# Altium project Class_D_Amp.PrjPcb
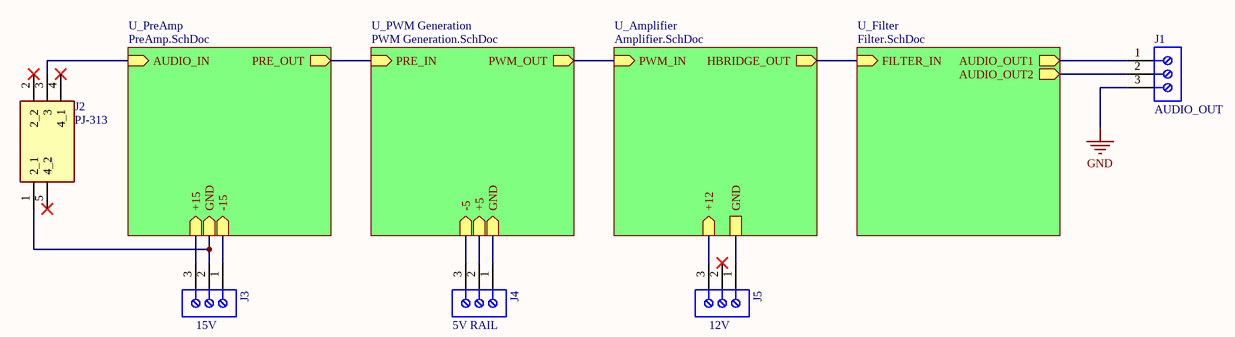
[diagram p0: Overview.SchDoc]
5 sheets, 63 parts. Net scope: hierarchical (ports join the sheet entries above them; power ports are global).
Board file: ClassD.PcbDoc
Sheets:
  Overview.SchDoc
    U_PreAmp = PreAmp.SchDoc
    U_Filter = Filter.SchDoc
    U_PWM Generation = PWM Generation.SchDoc
    U_Amplifier = Amplifier.SchDoc

## Sheet Overview.SchDoc
size A; SheetNumber: 1; SheetTotal: 5

### Parts
J1  AUDIO_OUT  [691137810003]
J2  PJ-313  [PJ313]
J3  15V  [691137810003]
J4  5V RAIL  [691137810003]
J5  12V  [691137810003]

### Sub-sheets
U_Amplifier = Amplifier.SchDoc: PWM_IN (in), HBRIDGE_OUT (out), +12 (in), GND
U_Filter = Filter.SchDoc: FILTER_IN (in), AUDIO_OUT1 (out), AUDIO_OUT2 (out)
U_PreAmp = PreAmp.SchDoc: AUDIO_IN (in), PRE_OUT (out), +15 (in), GND (in), -15 (in)
U_PWM Generation = PWM Generation.SchDoc: PRE_IN (in), PWM_OUT (out), -5 (in), +5 (in), GND (in)

### Nets
+5: J4.2 ; sheet U_PWM Generation/+5
+12: J5.3 ; sheet U_Amplifier/+12
+15: J3.3 ; sheet U_PreAmp/+15
-5: J4.3 ; sheet U_PWM Generation/-5
-15: J3.1 ; sheet U_PreAmp/-15
GND: J1.3 J2.1(2_1) J3.2 J4.1 J5.1 ; sheet U_PreAmp/GND, sheet U_PWM Generation/GND, sheet U_Amplifier/GND
AUDIO_IN: J2.3 ; sheet U_PreAmp/AUDIO_IN
AUDIO_OUT1: J1.1 ; sheet U_Filter/AUDIO_OUT1
AUDIO_OUT2: J1.2 ; sheet U_Filter/AUDIO_OUT2
PRE_OUT: sheet U_PreAmp/PRE_OUT, sheet U_PWM Generation/PRE_IN
PWM_IN: sheet U_PWM Generation/PWM_OUT, sheet U_Amplifier/PWM_IN
TS: sheet U_Filter/FILTER_IN, sheet U_Amplifier/HBRIDGE_OUT

Not connected (* = marked no-connect by the designer): J2 2(2_2)* 4(4_1)* 5(4_2)*; J5 2*

### Library data of the parts
J1 J3-J5 = CMP-1502-03382-3: 10.00 mm Terminal Block, Horizontal Entr / 691137810003
J2 = PJ-313: Connector; Manufacturer_Name: Haoyu; Datasheet Link: http://p.globalsources.com/IMAGES/PDT/SPEC/678/K1007224678.pdf; Height: 5mm; Manufacturer_Part_Number: PJ-313

## Sheet PreAmp.SchDoc
size A4; SheetNumber: 2; SheetTotal: 5
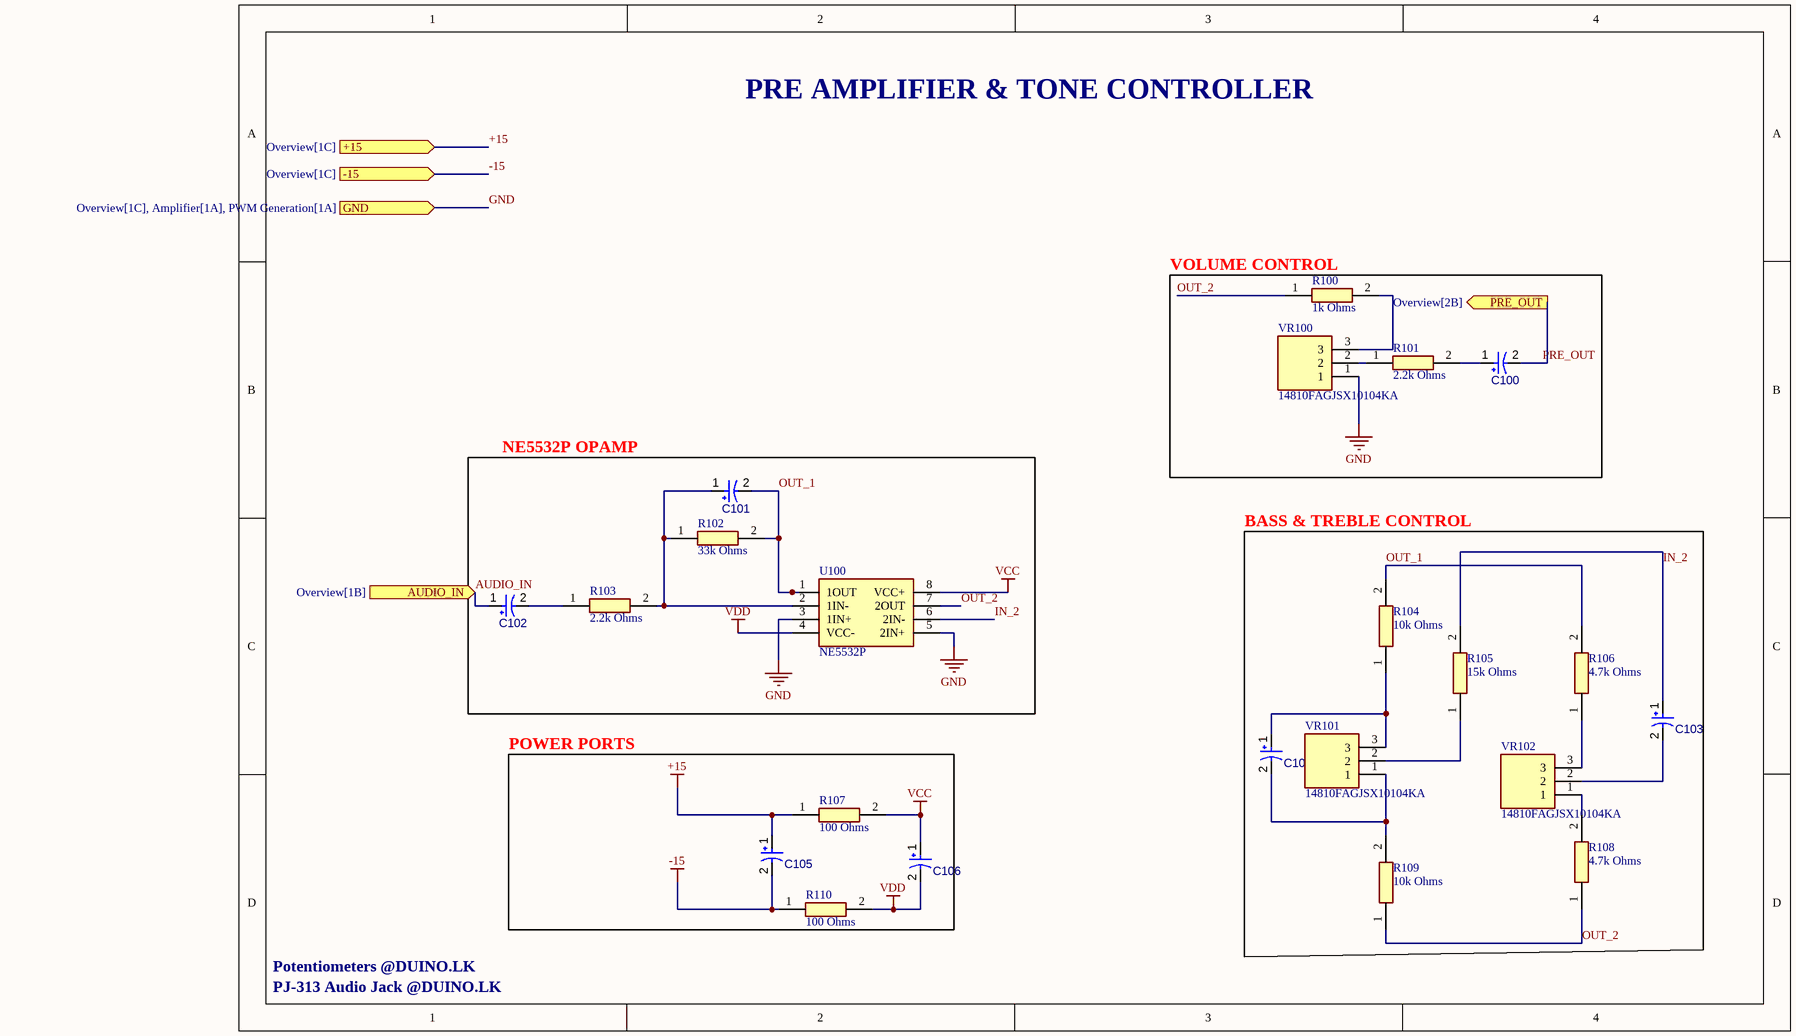
[diagram p1: PreAmp.SchDoc]

### Parts
C100  10uF  [CAPPR65-500-1600X1000X1700]  (value not drawn)
C101  47pF  [CAPPR65-500-1600X1000X1700]  (value not drawn)
C102  10uF  [CAPPR65-500-1600X1000X1700]  (value not drawn)
C103  2.2nF  [CAPPR65-500-1600X1000X1700]  (value not drawn)
C104  47nF  [CAPPR65-500-1600X1000X1700]  (value not drawn)
C105  1000uF  [CAPPR65-500-1600X1000X1700]  (value not drawn)
C106  100nF  [CAPPR65-500-1600X1000X1700]  (value not drawn)
R100  1k Ohms  [RESAD1650W60L650D250]
R101  2.2k Ohms  [RESAD1650W60L650D250]
R102  33k Ohms  [RESAD1650W60L650D250]
R103  2.2k Ohms  [RESAD1650W60L650D250]
R104  10k Ohms  [RESAD1650W60L650D250]
R105  15k Ohms  [RESAD1650W60L650D250]
R106  4.7k Ohms  [RESAD1650W60L650D250]
R107  100 Ohms  [RESAD1650W60L650D250]
R108  4.7k Ohms  [RESAD1650W60L650D250]
R109  10k Ohms  [RESAD1650W60L650D250]
R110  100 Ohms  [RESAD1650W60L650D250]
U100  NE5532P  [DIP794W53P254L959H508Q8N]
VR100  14810FAGJSX10104KA  [14810FAGJSX10104KA]
VR101  14810FAGJSX10104KA  [14810FAGJSX10104KA]
VR102  14810FAGJSX10104KA  [14810FAGJSX10104KA]

### Blocks framed on the sheet
VOLUME CONTROL: C100 R100 R101 VR100
NE5532P OPAMP: C101 C102 R102 R103 U100
BASS & TREBLE CONTROL: C103 C104 R104-R106 R108 R109 VR101 VR102
POWER PORTS: C105 C106 R107 R110

### Ports
+15 (in, see Overview[1C]), -15 (in, see Overview[1C]), AUDIO_IN (in, see Overview[1B]), GND (in, see Overview[1C], Amplifier[1A], PWM Generation[1A]), PRE_OUT (out, see Overview[2B])

### Nets
+15: C105.1 R107.1 ; port +15
-15: C105.2 R110.1 ; port -15
GND: U100.3(1IN+) U100.5(2IN+) VR100.1 ; port GND
VCC: C106.1 R107.2 U100.8(VCC+)
VDD: C106.2 R110.2 U100.4(VCC-)
AUDIO_IN: C102.1 ; port AUDIO_IN
IN_2: C103.1 R105.2 U100.6(2IN-)
OUT_1: C101.2 R102.2 R104.2 R106.2 U100.1(1OUT)
OUT_2: R100.1 R108.1 R109.1 U100.7(2OUT)
PRE_OUT: C100.2 ; port PRE_OUT
NetC100_1: C100.1 R101.2
NetC101_1: C101.1 R102.1 R103.2 U100.2(1IN-)
NetC102_2: C102.2 R103.1
NetC103_2: C103.2 VR102.2
NetC104_1: C104.1 R104.1 VR101.3
NetC104_2: C104.2 R109.2 VR101.1
NetR100_2: R100.2 VR100.3
NetR101_1: R101.1 VR100.2
NetR105_1: R105.1 VR101.2
NetR106_1: R106.1 VR102.3
NetR108_2: R108.2 VR102.1

### Notes on the sheet
- PRE AMPLIFIER & TONE CONTROLLER
- Potentiometers @DUINO.LK
- PJ-313 Audio Jack @DUINO.LK

### Library data of the parts
C100-C106 = CMP-001-00034-7: Manufacturer: Panasonic; Capacitor Type: Electrolytic; Voltage Rating: 100V; Tolerance: 20%; Value: 100µF; Ripple Current: 350mA; Mounting Technology: TH; Case/Package: Radial; Pins: 2; RoHS Compliant: True; Min Operating Temperature: -40°C; Max Operating Temperature: 85°C; Ripple Current (AC): 350mA; Package Quantity: 200; Package Description: 2-Pin Through Hole Device, Dia 10 mm, Body Length 16 mm; Package Reference: CAPPR65-500-1600X1000X1700; Datasheet URL: https://industrial.panasonic.com/cdbs/www-data/pdf/RDF0000/ABA0000C1047.pdf; Manufacturer URL: http://www.panasonic.com/; Packaging: Bulk; Datasheet Version: Mar-16; Diameter: 10mm; Lead Pitch: 5mm
R100-R110 = MRS25000C1052FCT00: Resistor; Manufacturer_Name: Vishay; Datasheet Link: http://www.vishay.com/docs/28724/mrs16m25.pdf; Manufacturer_Part_Number: MRS25000C1052FCT00; Mouser Part Number: 594-MRS25000C1052FCT; Mouser Price/Stock: https://www.mouser.co.uk/ProductDetail/Vishay-BC-Components/MRS25000C1052FCT00?qs=17u8i%2FzlE88YYQWf3OHpPg%3D%3D
U100 = NE5532P: Integrated Circuit; Manufacturer_Name: Texas Instruments; Datasheet Link: http://www.ti.com/lit/ds/symlink/ne5532a.pdf; Height: 5.08mm; Manufacturer_Part_Number: NE5532P; Mouser Part Number: 595-NE5532P; Mouser Price/Stock: https://www.mouser.co.uk/ProductDetail/Texas-Instruments/NE5532P?qs=3pnr37ZAbK%252Bre0OAHDmGsw%3D%3D; Arrow Part Number: NE5532P; Arrow Price/Stock: https://www.arrow.com/en/products/ne5532p/texas-instruments?region=nac
VR100-VR102 = 14810FAGJSX10104KA: Variable Resistor; Manufacturer_Name: Vishay; Datasheet Link: https://www.mouser.co.uk/datasheet/2/427/148149-239924.pdf; Height: 13.1mm; Manufacturer_Part_Number: 14810FAGJSX10104KA; Mouser Part Number: 594-148-7104; Mouser Price/Stock: https://www.mouser.co.uk/ProductDetail/Vishay-Spectrol/14810FAGJSX10104KA?qs=jxJUw0%2FAXLKQRjwLM10Vhg%3D%3D

## Sheet Filter.SchDoc
size 114 x 127 mm; SheetNumber: 4; SheetTotal: 5
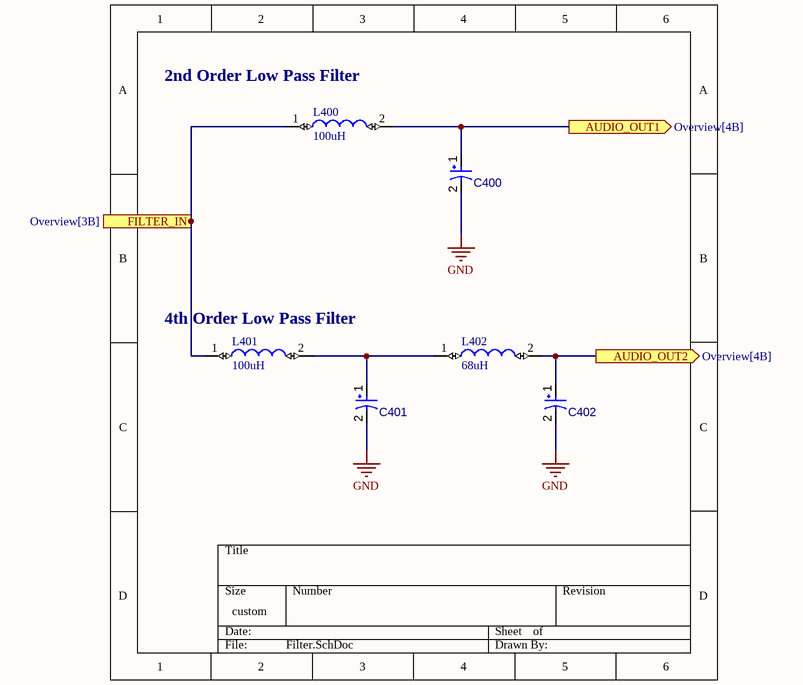
[diagram p2: Filter.SchDoc]

### Parts
C400  630nF  [CAPPR65-500-1600X1000X1700]  (value not drawn)
C401  1.5uF  [CAPPR65-500-1600X1000X1700]  (value not drawn)
C402  390nF  [CAPPR65-500-1600X1000X1700]  (value not drawn)
L400  100uH  [RLB0914]
L401  100uH  [RLB0914]
L402  68uH  [RLB0914]

### Ports
AUDIO_OUT1 (out, see Overview[4B]), AUDIO_OUT2 (out, see Overview[4B]), FILTER_IN (in, see Overview[3B])

### Nets
GND: C400.2 C401.2 C402.2
AUDIO_OUT1: C400.1 L400.2 ; port AUDIO_OUT1
AUDIO_OUT2: C402.1 L402.2 ; port AUDIO_OUT2
TS: L400.1 L401.1 ; port FILTER_IN
NetC401_1: C401.1 L401.2 L402.1

### Notes on the sheet
- (near L400) 2nd Order Low Pass Filter
- (near L401) 4th Order Low Pass Filter

### Library data of the parts
C400-C402 = CMP-001-00034-7: as C100 on sheet PreAmp; Mounting Technology: TH; Case/Package: Radial; Pins: 2; RoHS Compliant: True; Min Operating Temperature: -40°C; Max Operating Temperature: 85°C; Ripple Current (AC): 350mA; Package Quantity: 200; Package Description: 2-Pin Through Hole Device, Dia 10 mm, Body Length 16 mm; Package Reference: CAPPR65-500-1600X1000X1700; Datasheet URL: https://industrial.panasonic.com/cdbs/www-data/pdf/RDF0000/ABA0000C1047.pdf; Manufacturer URL: http://www.panasonic.com/; Packaging: Bulk; Datasheet Version: Mar-16; Diameter: 10mm; Lead Pitch: 5mm
L400-L402 = RLB0914-101KL: 100uH Through Hole Inductor; Manufacturer_Name: Bourns; Datasheet Link: https://componentsearchengine.com/Datasheets/2/RLB0914-101KL.pdf; Manufacturer_Part_Number: RLB0914-101KL; Mouser Part Number: 652-RLB0914-101KL; Mouser Price/Stock: https://www.mouser.co.uk/ProductDetail/Bourns/RLB0914-101KL?qs=AC4ivEYFOTDvh%252BZyhliaeA%3D%3D; Arrow Part Number: RLB0914-101KL; Arrow Price/Stock: https://www.arrow.com/en/products/rlb0914-101kl/bourns?region=europe

## Sheet PWM Generation.SchDoc
size A; SheetNumber: 5; SheetTotal: 5
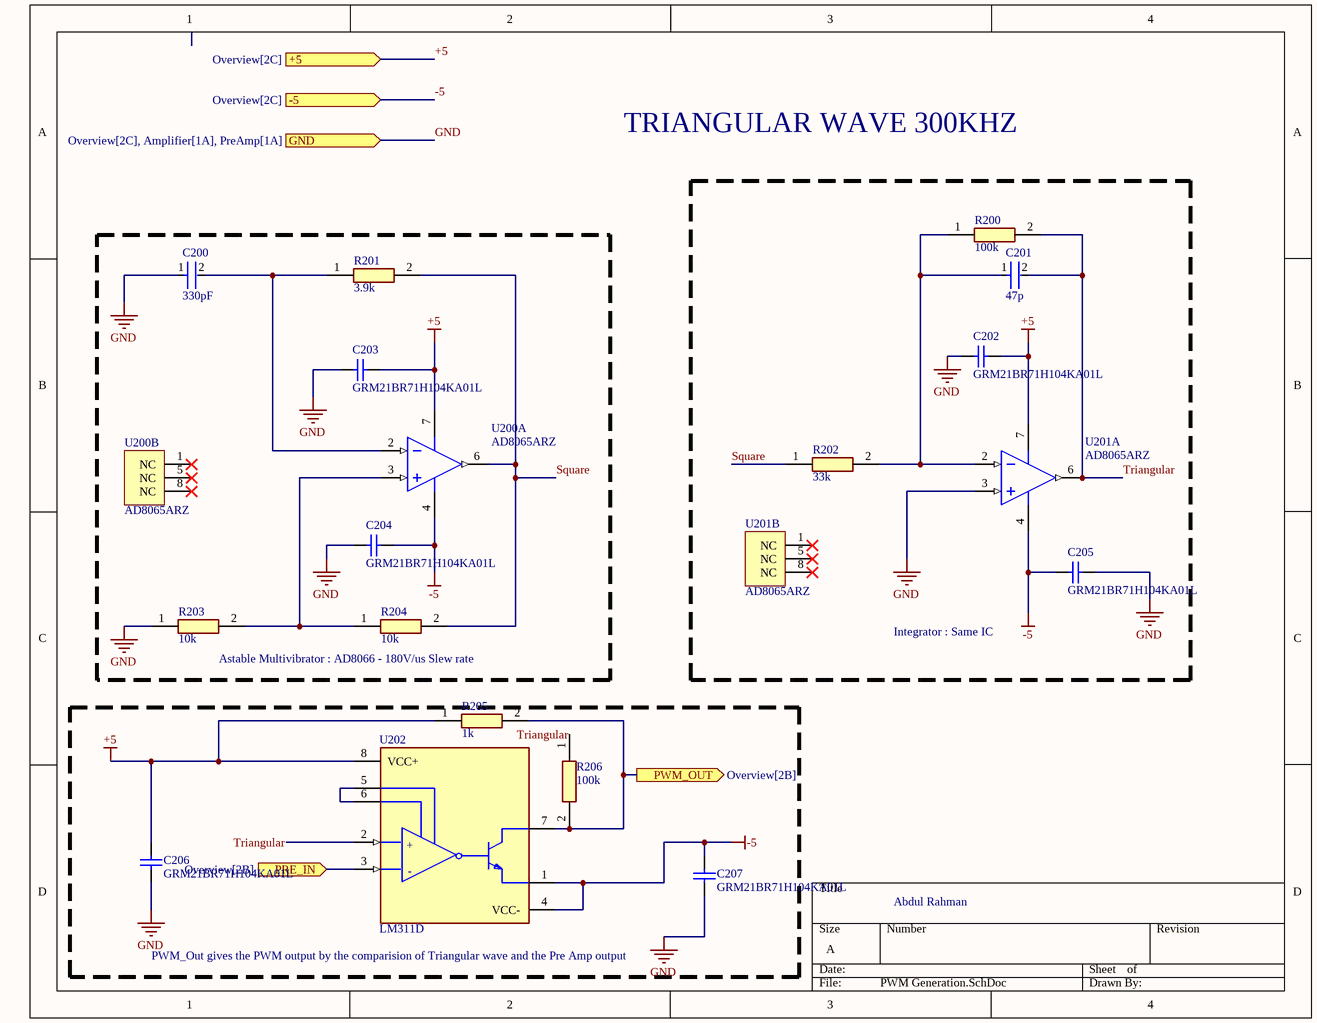
[diagram p3: PWM Generation.SchDoc]

### Parts
C200  330pF  [FP-RCE1K1-3_15-MFG]
C201  47p  [FP-RCE1K1-3_15-MFG]
C202  GRM21BR71H104KA01L  [CAPC2013X135X45ML10T25]
C203  GRM21BR71H104KA01L  [CAPC2013X135X45ML10T25]
C204  GRM21BR71H104KA01L  [CAPC2013X135X45ML10T25]
C205  GRM21BR71H104KA01L  [CAPC2013X135X45ML10T25]
C206  GRM21BR71H104KA01L  [CAPC2013X135X45ML10T25]
C207  GRM21BR71H104KA01L  [CAPC2013X135X45ML10T25]
R200  100k  [RESAD1650W60L650D250]
R201  3.9k  [RESAD1650W60L650D250]
R202  33k  [RESAD1650W60L650D250]
R203  10k  [RESAD1650W60L650D250]
R204  10k  [RESAD1650W60L650D250]
R205  1k  [RESAD1650W60L650D250]
R206  100k  [RESAD1650W60L650D250]
U200  AD8065ARZ  [ADI-R-8_N]  (parts A,B of 2)
U201  AD8065ARZ  [ADI-R-8_N]  (parts A,B of 2)
U202  LM311D  [FP-D0008A-MFG]

### Blocks framed on the sheet
Integrator : Same IC: C201 C202 C205 R200 R202 U201
Astable Multivibrator : AD8066 - 180V/us Slew rate: C200 C203 C204 R201 R203 R204 U200

### Ports
+5 (in, see Overview[2C]), -5 (in, see Overview[2C]), GND (in, see Overview[2C], Amplifier[1A], PreAmp[1A]), PRE_IN (in, see Overview[2B]), PWM_OUT (out, see Overview[2B])

### Nets
+5: C202.1 C203.1 C206.2 R205.1 U200.7(+VS) U201.7(+VS) U202.8(VCC+) ; port +5
-5: C204.1 C205.2 C207.2 U200.4(-VS) U201.4(-VS) U202.1(EMIT_OUT) U202.4(VCC-) ; port -5
GND: C200.1 C202.2 C203.2 C204.2 C205.1 C206.1 C207.1 R203.1 U201.3(+IN) ; port GND
PRE_OUT: U202.3(IN-) ; port PRE_IN
PWM_IN: R205.2 R206.2 U202.7(COL_OUT) ; port PWM_OUT
Square: R201.2 R202.1 R204.2 U200.6(VOUT)
Triangular: C201.2 R200.2 R206.1 U201.6(VOUT) U202.2(IN+)
NetC200_2: C200.2 R201.1 U200.2(-IN)
NetC201_1: C201.1 R200.1 R202.2 U201.2(-IN)
NetR203_2: R203.2 R204.1 U200.3(+IN)
NetU202_5: U202.5(BALANCE) U202.6(BAL/STRB)

Not connected (* = marked no-connect by the designer): U200 1(NC)* 5(NC)* 8(NC)*; U201 1(NC)* 5(NC)* 8(NC)*

### Notes on the sheet
- TRIANGULAR WAVE 300KHZ
- Abdul Rahman
- (near U202) PWM_Out gives the PWM output by the comparision of Triangular wave and the Pre Amp output
- (in symbol CMP-04896-000022-1) +; -

### Library data of the parts
C200 C201 = CMP-06035-025793-1: Capacitor
C202-C207 = CMP-2100-03644-1: Chip Capacitor, 0.1 uF, +/- 10%, 50 V, -55 to 125 degC, 0805 (2012 Metric), RoHS, Tape and Reel; Manufacturer: Murata; Voltage: 50V; Capacitance: 100nF; Insulation Resistance: 10GR; Dielectric Material: Ceramic; Dielectric: X7R; Package Description: 2-Pin Surface Mount Device, Body 2 x 1.25 mm; Manufacturer URL: http://www.murata.com/; Case Code (Imperial): 0805; Datasheet URL: http://psearch.en.murata.com/capacitor/product/GRM21BR71H104KA01%23.pdf; Termination: SMD/SMT; Lead Free: LeadFree; Package Quantity: 1; Mount: SurfaceMount; REACH SVHC: Unknown; Thickness: 0.053inch; Height: 1.25mm; Case/Package: 0805; Voltage Rating: 50V; Width: 0.049inch; Case Code (Metric): 2012; Material: Ceramic; Min Operating Temperature: -55degC; RoHSCompliant: true; Datasheet Version: 42675.0; Voltage Rating (DC): 50V; Tolerance: 10%; Package Reference: 0805; Depth: 1.25mm; Length: 2mm; Max Operating Temperature: 125degC; Packaging: TapeandReel; Number of Pins: 2; Radiation Hardening: No
R200-R206 = PR01000101001JR500: Resistor; Manufacturer_Name: Vishay; Datasheet Link: https://componentsearchengine.com/Datasheets/2/PR01000101001JR500.pdf; Manufacturer_Part_Number: PR01000101001JR500; Mouser Part Number: 594-5073NW1K000J; Mouser Price/Stock: https://www.mouser.co.uk/ProductDetail/Vishay-BC-Components/PR01000101001JR500?qs=LCMWAU1DZcz1DDPbu%2F9jJQ%3D%3D; Arrow Part Number: PR01000101001JR500; Arrow Price/Stock: https://www.arrow.com/en/products/pr01000101001jr500/vishay?region=nac
U200 U201 = CMP-0384-01216-2: Single Channel Low Power Operational Amplifier, 145 MHz BW, 180 V/us SR, Industrial, 8-pin SOIC (R-8), Tube; Manufacturer: Analog Devices; Generic Part Number: AD8065; V Span Max: 24V; Iq/Amp: 7.4mA; V Span Min: 5V; Input Bias Current: 2pA; Automotive Qualified: Yes; Input Offset Voltage: 400uV; Small Signal Bandwidth: 145MHz; Amplifiers Per Package: 1; PackageDescription: 8-Pin Standard Small Outline Package, Body 3.9 x 4.9 mm, Pitch 1.27 mm; Code_JEDEC: MS-012-AA; ComponentLink2Description: Datasheet; ComponentLink4Description: Reference Circuit; PackageReference: R-8; Slew Rate: 180V/us; PartNumber: AD8065ARZ; ComponentLink1URL: http://www.analog.com/en/index.html; ComponentLink4URL: http://www.analog.com/en/all-operational-amplifiers-op-amps/operational-amplifiers-op-amps/ad8065/products/product.html#product-recommendations; RevisionNote: Reference Circuit URL fixed; ComponentLink1Description: Manufacturer URL; PackageVersion: 060506-A; ComponentLink2URL: http://www.analog.com/static/imported-files/data_sheets/AD8065_8066.pdf; ComponentLink3URL: http://www.analog.com/static/imported-files/packages/PKG_PDF/SOIC_Narrow%20(R)/R_8.pdf; ComponentLink3Description: Package Specification; Mounting Technology: Surface Mount; DatasheetVersion: Rev. J
U202 = CMP-04896-000022-1: IC DIFF COMP W/STROBE 8-SOIC; Manufacturer: Texas Instruments; Standoff Height: 0.11mm; Max Junction Temp: +150°C; Voltage Gain: 200V/mV; Input Offset Voltage: 2mV; Min Supply Voltage: 3.5V; Response Time: 165ns; Max Supply Voltage: 30V; Number Of Channels: 1; Input Bias Current: 0.1uA; Nominal Supply Current: 5.1mA; Automotive: No; Temperature Range High: +70°C; Lead Free: Yes; Ambient Temperature Range Low: 0°C; ComponentLink2URL: http://www.ti.com/lit/ds/symlink/lm311.pdf; Ambient Temperature Range High: +70°C; Manufacturer Part Number: LM311D; Package: D0008A; Temperature Range Low: 0°C; RoHS: TRUE; Digikey Description: IC DIFF COMP W/STROBE 8-SOIC; ComponentLink2Description: Datasheet; Temperature: 0°C to +70°C; Height: 1.75mm; Category: IC; Device Class L1: Integrated Circuits (ICs); Ipc Land Pattern Name: SOIC127P600X175-8; Octopart: https://octopart.com/lm311d-texas+instruments-428348; Device Class L3: Comparators; Mouser Description: Analog Comparators Single Channler; Device Class L2: Linear ICs

## Sheet Amplifier.SchDoc
size A; SheetNumber: 3; SheetTotal: 5
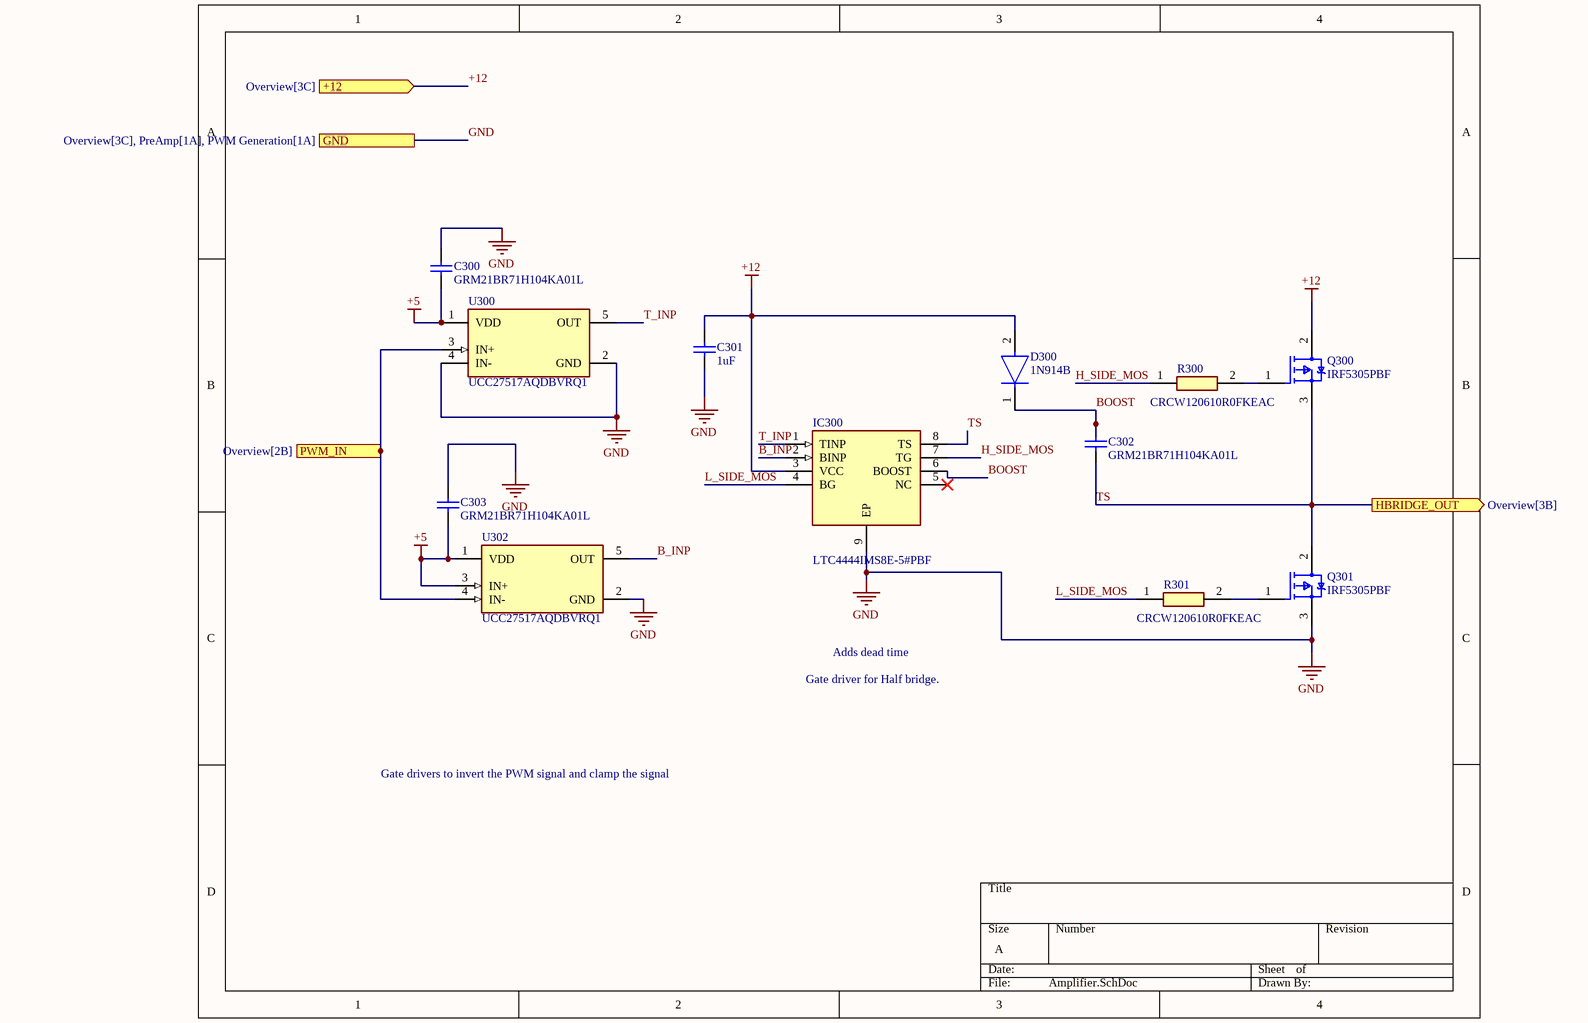
[diagram p4: Amplifier.SchDoc]

### Parts
C300  GRM21BR71H104KA01L  [CAPC2013X135X45ML10T25]
C301  1uF  [CAPC2013X140X50LL20T25]
C302  GRM21BR71H104KA01L  [CAPC2013X135X45ML10T25]
C303  GRM21BR71H104KA01L  [CAPC2013X135X45ML10T25]
D300  1N914B  [FP-017AG-MFG]
IC300  LTC4444IMS8E-5#PBF  [SOP65P490X110-9N]
Q300  IRF5305PBF  [FP-PG-TO220-3-0]
Q301  IRF5305PBF  [FP-PG-TO220-3-0]
R300  CRCW120610R0FKEAC  [RESC3216X60N]
R301  CRCW120610R0FKEAC  [RESC3216X60N]
U300  UCC27517AQDBVRQ1  [FP-DBV0005A-IPC_B]
U302  UCC27517AQDBVRQ1  [FP-DBV0005A-IPC_B]

### Ports
+12 (in, see Overview[3C]), GND (see Overview[3C], PreAmp[1A], PWM Generation[1A]), HBRIDGE_OUT (out, see Overview[3B]), PWM_IN (in, see Overview[2B])

### Nets
+5: C300.1 C303.1 U300.1(VDD) U302.1(VDD) U302.3(IN+)
+12: C301.1 D300.2(A) IC300.3(VCC) Q300.2(D) ; port +12
GND: C300.2 C301.2 C303.2 IC300.9(EP) Q301.3(S) U300.2(GND) U300.4(IN-) U302.2(GND) ; port GND
B_INP: IC300.2(BINP) U302.5(OUT)
BOOST: C302.2 D300.1(C) IC300.6(BOOST)
H_SIDE_MOS: IC300.7(TG) R300.1
L_SIDE_MOS: IC300.4(BG) R301.1
PWM_IN: U300.3(IN+) U302.4(IN-) ; port PWM_IN
T_INP: IC300.1(TINP) U300.5(OUT)
TS: C302.1 IC300.8(TS) Q300.3(S) Q301.2(D) ; port HBRIDGE_OUT
NetQ300_1: Q300.1(G) R300.2
NetQ301_1: Q301.1(G) R301.2

Not connected (* = marked no-connect by the designer): IC300 5(NC)*

### Notes on the sheet
- Gate driver for Half bridge.
- Adds dead time
- Gate drivers to invert the PWM signal and clamp the signal

### Library data of the parts
C300 C302 C303 = CMP-2100-03644-1: as C202 on sheet PWM Generation; Package Description: 2-Pin Surface Mount Device, Body 2 x 1.25 mm; Manufacturer URL: http://www.murata.com/; Case Code (Imperial): 0805; Datasheet URL: http://psearch.en.murata.com/capacitor/product/GRM21BR71H104KA01%23.pdf; Termination: SMD/SMT; Lead Free: LeadFree; Package Quantity: 1; Mount: SurfaceMount; REACH SVHC: Unknown; Thickness: 0.053inch; Height: 1.25mm; Case/Package: 0805; Voltage Rating: 50V; Width: 0.049inch; Case Code (Metric): 2012; Material: Ceramic; Min Operating Temperature: -55degC; RoHSCompliant: true; Datasheet Version: 42675.0; Voltage Rating (DC): 50V; Tolerance: 10%; Package Reference: 0805; Depth: 1.25mm; Length: 2mm; Max Operating Temperature: 125degC; Packaging: TapeandReel; Number of Pins: 2; Radiation Hardening: No
C301 = CMP-2007-03234-1: C0805C105K3RACTU; Manufacturer: Kemet; Part Number: C0805C105K3RACTU
D300 = CMP-07163-000001-1: DIODE GEN PURP 100V 200MA DO35; Manufacturer: ON Semiconductor; Forward Current: 300mA; Max Junction Temp: +175°C; Peak Reverse Current: 5uA; Value: 4pF; Max Surge Forward Current: 1A; Device Class L1: Discrete Semiconductors; Manufacturer Part Number: 1N914B; Automotive: No; Temperature: -55°C to +175°C; Temperature Range Low: -55°C; Reverse Voltage: 100V; Category: Diode; Footprint Url: https://www.onsemi.com/pub/Collateral/017AG.PDF; Package: 017AG; Lead Free: Yes; Digikey Description: DIODE GEN PURP 100V 200MA DO35; Height: 1.91mm; Device Class L3: Rectifier Diodes; ComponentLink2URL: https://www.onsemi.com/pub/Collateral/1N914-D.PDF; Octopart: https://octopart.com/1n914b-on+semiconductor-84323163; Capacitance: 4pF; Device Class L2: Diodes; Mouser Description: Diodes - General Purpose, Power, Switching 100V Io/200mA BULK; RoHS: TRUE; Max Repetitive Reverse Voltage: 100V; Temperature Range High: +175°C; ComponentLink2Description: Datasheet
IC300 = LTC4444IMS8E-5#PBF: Integrated Circuit; Manufacturer_Name: Analog Devices; Datasheet Link: http://cds.linear.com/docs/en/datasheet/4444fb.pdf; Height: 1.1mm; Manufacturer_Part_Number: LTC4444IMS8E-5#PBF; Mouser Part Number: 584-C4444IMS8E-5PBF; Mouser Price/Stock: https://www.mouser.co.uk/ProductDetail/Analog-Devices/LTC4444IMS8E-5PBF?qs=hVkxg5c3xu%2F0%252Bh2dIFcpbw%3D%3D; Arrow Part Number: LTC4444IMS8E-5#PBF; Arrow Price/Stock: https://www.arrow.com/en/products/ltc4444ims8e-5pbf/linear-technology
Q300 Q301 = CMP-32901-000003-1: MOSFET P-CH 55V 31A TO-220AB; Manufacturer: Infineon; Max Forward Diode Voltage: -1.3V; Continuous Drain Current: -31A; Standoff Height: 3.55mm; Power Dissipation: 110W; Number Of Channels: 1; Rthja Max: 62°C/W; Depletion Mode: False; Drain To Source Resistance: 0.06Ω; Input Capacitace At Vds: 1200pF @ -25V; Reverse Recovery Time: 71ns; Gate Charge At Vgs: 63nC @ -10V; Gate To Source Voltage: 20V; Turn Off Delay Time: 39ns; Turn On Delay Time: 14ns; Drain To Source Breakdown Voltage: -55V; Threshold Vgs Min: -2V; Max Junction Temp: +175°C; Pulse Drain Current: -110A; Reverse Recovery Charge: 170nC; Threshold Vgs Max: -4V; Device Class L1: Discrete Semiconductors; Lead Free: Yes; Temperature Range High: +175°C; Device Class L2: Transistors; Package: PG-TO220-3; Octopart: https://octopart.com/irf5305pbf-infineon-65873396; RoHS: TRUE; Number Of P Channels: 1; Manufacturer Part Number: IRF5305PBF; Category: Trans; Digikey Description: MOSFET P-CH 55V 31A TO-220AB; Device Class L3: MOSFETs; Height: 19.3mm; Automotive: No; Temperature Range Low: -55°C; Temperature: -55°C to +175°C; ComponentLink2URL: https://www.infineon.com/dgdl/irf5305pbf.pdf?fileId=5546d462533600a4015355e370101993; Drain To Source Voltage: -55V; ComponentLink2Description: Datasheet
R300 R301 = CRCW120610R0FKEAC: Resistor; Manufacturer_Name: Vishay; Datasheet Link: http://componentsearchengine.com/Datasheets/1/CRCW120610R0FKEAC.pdf; Height: 0.6mm; Manufacturer_Part_Number: CRCW120610R0FKEAC; Mouser Part Number: 71-CRCW120610R0FKEAC; Mouser Price/Stock: https://www.mouser.co.uk/ProductDetail/Vishay-Dale/CRCW120610R0FKEAC?qs=E3Y5ESvWgWOByB05FGvXRQ%3D%3D; Arrow Part Number: CRCW120610R0FKEAC; Arrow Price/Stock: https://www.arrow.com/en/products/crcw120610r0fkeac/vishay?utm_currency=USD&region=nac
U300 U302 = CMP-04912-000026-1: IC GATE DVR LOW SIDE 1CH SOT23-5; Max Output Current: 4A; Number of Outputs: 1; Channel Type: Single; Min Supply Voltage: 4.5V; Max Supply Voltage: 18V; Lead Free: Lead Free; Number of Channels: 1; Radiation Hardening: No; Packaging: Tape and Reel; Max Operating Temperature: 125°C; Number of Drivers: 1; Min Operating Temperature: -40°C; Case/Package: SOT-23-5; Number of Pins: 5; Package Quantity: 3000; Mount: Surface Mount

## Nets that join several sheets
+5: Overview (J4.2), PWM Generation (7 pins), Amplifier (5 pins)
+12: Overview (J5.3), Amplifier (C301.1 D300.2 IC300.3 Q300.2)
+15: Overview (J3.3), PreAmp (C105.1 R107.1)
-5: Overview (J4.3), PWM Generation (7 pins)
-15: Overview (J3.1), PreAmp (C105.2 R110.1)
GND: Overview (5 pins), PreAmp (U100.3 U100.5 VR100.1), Filter (C400.2 C401.2 C402.2), PWM Generation (9 pins), Amplifier (8 pins)
AUDIO_IN: Overview (J2.3), PreAmp (C102.1)
AUDIO_OUT1: Overview (J1.1), Filter (C400.1 L400.2)
AUDIO_OUT2: Overview (J1.2), Filter (C402.1 L402.2)
PRE_OUT: PreAmp (C100.2), PWM Generation (U202.3)
PWM_IN: PWM Generation (R205.2 R206.2 U202.7), Amplifier (U300.3 U302.4)
TS: Filter (L400.1 L401.1), Amplifier (C302.1 IC300.8 Q300.3 Q301.2)